# Altium project 20_AS_NodePCB.PrjPcb
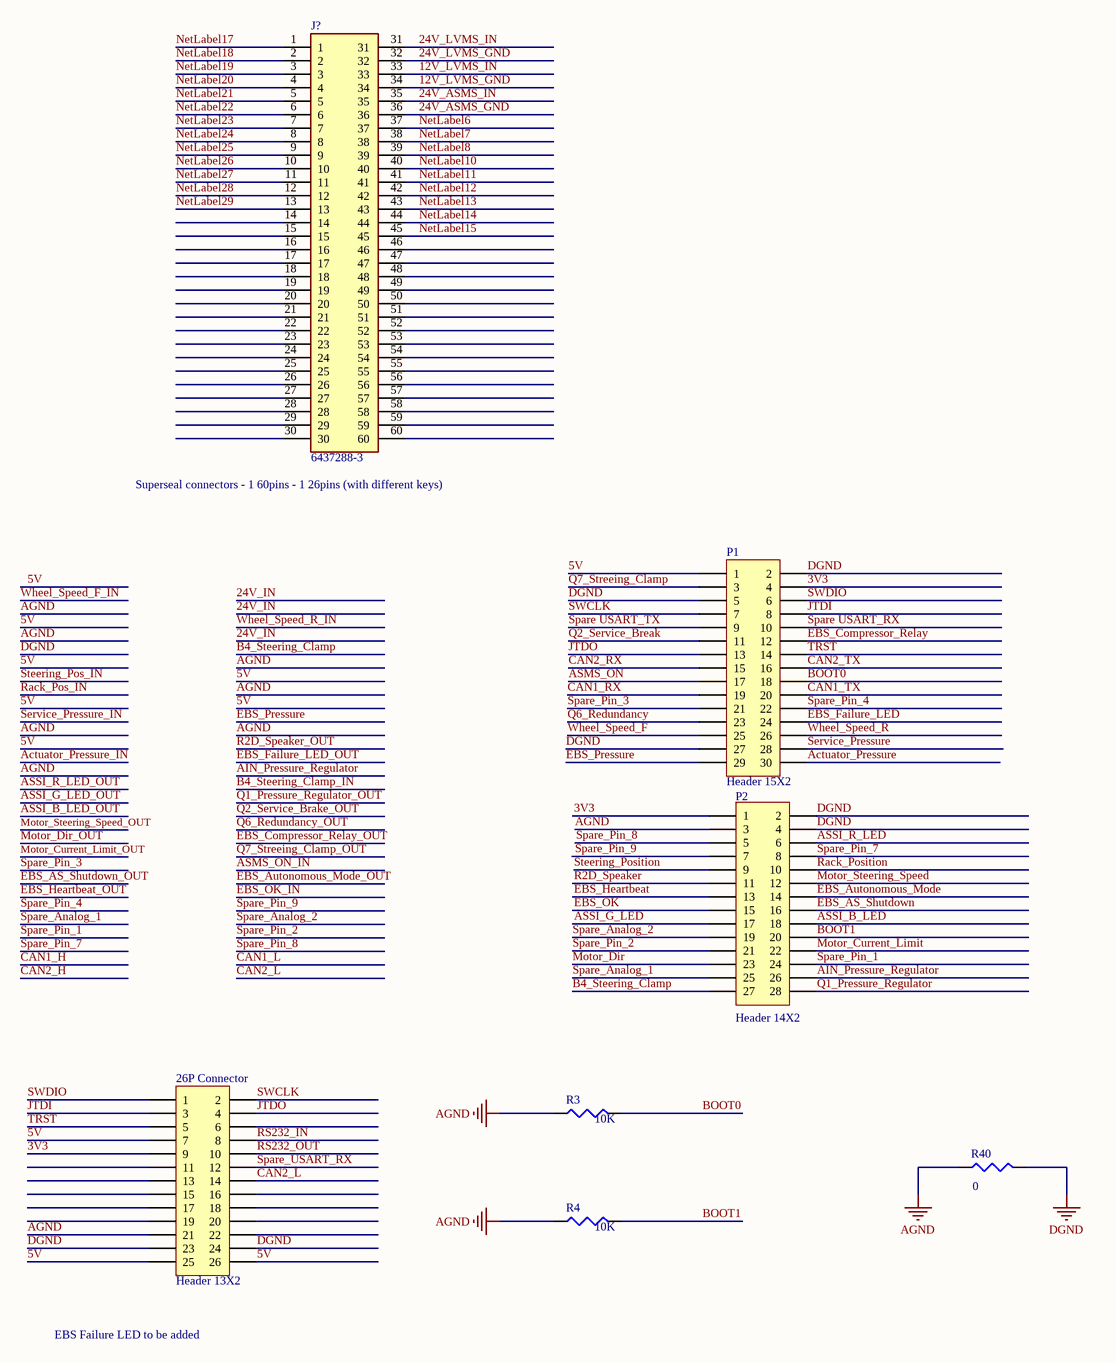
[diagram p0: AS_Node_Connectors.SchDoc]
3 sheets, 44 parts. Net scope: global (net labels, ports and power ports of the same name join across sheets).
Board file: AS_node_pcb_version2.PcbDoc
Sheets:
  AS_Node_Connectors.SchDoc
  AS_Node_Inputs.SchDoc
  AS_Node_Voltage_Regulators.SchDoc

## Sheet AS_Node_Connectors.SchDoc
size A2

### Parts
26P_Connector  Header 13X2  [CONN26_9-6437287]
J?  6437288-3  [6437288-3]
P1  Header 15X2  [30_connector_male]
P2  Header 14X2  [28 _connector_male]
R3  value 10K  [SMD-0805-RES]  (hidden comment: Res3)
R4  value 10K  [SMD-0805-RES]  (hidden comment: Res3)
R40  value 0  [SMD-0805-RES]  (hidden comment: Res3)

### Nets
3V3: 26P_Connector.9 P1.4 P2.1
AGND: 26P_Connector.21 P2.3 R3.1 R4.1 R40.1
DGND: 26P_Connector.23 26P_Connector.24 P1.2 P1.5 P1.27 P2.2 P2.4 R40.2
5V: 26P_Connector.7 26P_Connector.25 26P_Connector.26 P1.1
12V_LVMS_GND: J?.34
12V_LVMS_IN: J?.33
24V_ASMS_GND: J?.36
24V_ASMS_IN: J?.35
24V_LVMS_GND: J?.32
24V_LVMS_IN: J?.31
Actuator_Pressure: P1.30
AIN_Pressure_Regulator: P2.26
ASMS_ON: P1.17
ASSI_B_LED: P2.18
ASSI_G_LED: P2.17
ASSI_R_LED: P2.6
B4_Steering_Clamp: P2.27
BOOT0: P1.18 R3.2
BOOT1: P2.20 R4.2
CAN1_RX: P1.19
CAN1_TX: P1.20
CAN2_L: 26P_Connector.14
CAN2_RX: P1.15
CAN2_TX: P1.16
EBS_AS_Shutdown: P2.16
EBS_Autonomous_Mode: P2.14
EBS_Compressor_Relay: P1.12
EBS_Failure_LED: P1.24
EBS_Heartbeat: P2.13
EBS_OK: P2.15
EBS_Pressure: P1.29
JTDI: 26P_Connector.3 P1.8
JTDO: 26P_Connector.4 P1.13
Motor_Current_Limit: P2.22
Motor_Dir: P2.23
Motor_Steering_Speed: P2.12
NetLabel6: J?.37
NetLabel7: J?.38
NetLabel8: J?.39
NetLabel10: J?.40
NetLabel11: J?.41
NetLabel12: J?.42
NetLabel13: J?.43
NetLabel14: J?.44
NetLabel15: J?.45
NetLabel17: J?.1
NetLabel18: J?.2
NetLabel19: J?.3
NetLabel20: J?.4
NetLabel21: J?.5
NetLabel22: J?.6
NetLabel23: J?.7
NetLabel24: J?.8
NetLabel25: J?.9
NetLabel26: J?.10
NetLabel27: J?.11
NetLabel28: J?.12
NetLabel29: J?.13
Q1_Pressure_Regulator: P2.28
Q2_Service_Break: P1.11
Q6_Redundancy: P1.23
Q7_Streeing_Clamp: P1.3
R2D_Speaker: P2.11
Rack_Position: P2.10
RS232_IN: 26P_Connector.8
RS232_OUT: 26P_Connector.10
Service_Pressure: P1.28
Spare USART_RX: P1.10
Spare USART_TX: P1.9
Spare_Analog_1: P2.25
Spare_Analog_2: P2.19
Spare_Pin_1: P2.24
Spare_Pin_2: P2.21
Spare_Pin_3: P1.21
Spare_Pin_4: P1.22
Spare_Pin_7: P2.8
Spare_Pin_8: P2.5
Spare_Pin_9: P2.7
Spare_USART_RX: 26P_Connector.12
Steering_Position: P2.9
SWCLK: 26P_Connector.2 P1.7
SWDIO: 26P_Connector.1 P1.6
TRST: 26P_Connector.5 P1.14
Wheel_Speed_F: P1.25
Wheel_Speed_R: P1.26

Not connected (* = marked no-connect by the designer): 26P_Connector 6 11 13 15 16 17 18 19 20 22; J? 14 15 16 17 18 19 20 21 22 23 24 25 26 27 28 29 30 46 47 48 49 50 51 52 53 54 55 56 57 58 59 60

### Notes on the sheet
- (near J?) Superseal connectors - 1 60pins - 1 26pins (with different keys)
- EBS Failure LED to be added

### Library data of the parts
26P_Connector = Header 13X2: Header, 13-Pin, Dual row; LatestRevisionDate: 17-Jul-2002; LatestRevisionNote: Re-released for DXP Platform.; Publisher: Altium Limited
J? = 6437288-3: Connector; Manufacturer_Name: TE Connectivity; Datasheet Link: https://componentsearchengine.com/Datasheets/1/6437288-3.pdf; Mouser2 Part Number: 571-6437288-3; Mouser2 Price/Stock: https://www.mouser.com/Search/Refine.aspx?Keyword=571-6437288-3; Manufacturer_Part_Number: 6437288-3
P1 = Header 15X2: Header, 15-Pin, Dual row; Manufacturer: Wurth Electronics Inc; Manufacturer Part Number: 61303021121; Connector Type: Header, Unshrouded; Number of Positions: 30; Number of Positions Loaded: All; Pitch: 0.100" (2.54mm); Supplier 1: Digi-Key; Supplier Part Number 1: 732-5306-ND; RoHS: RoHS Compliant; Category: Connectors, Interconnects; Stock 1: 127; Pricing 1: 1=1.57, 100=1.404, 500=1.188, 10000=0.702 (USD); Packaging: Bulk; Part Status: Active; Contact Type: Male Pin; Number of Rows: 2; Row Spacing: 0.100" (2.54mm); Contact Mating Length: 0.236" (6.00mm); Mounting Type: Through Hole; Termination: Solder; Fastening Type: -; Features: -; Contact Finish: Gold; Contact Finish Thickness: -; Color: Black; ComponentLink1URL: http://katalog.we-online.de/em/datasheet/6130xx21121.pdf; ComponentLink1Description: http://katalog.we-online.de/em/datasheet/6130xx21121.pdf
P2 = Header 14X2: Header, 14-Pin, Dual row; Manufacturer: Wurth Electronics Inc; Manufacturer Part Number: 61302821121; Connector Type: Header, Unshrouded; Number of Positions: 28; Number of Positions Loaded: All; Pitch: 0.100" (2.54mm); Supplier 1: Digi-Key; Supplier Part Number 1: 732-5305-ND; RoHS: RoHS Compliant; Category: Connectors, Interconnects; Stock 1: 2; Pricing 1: 1=1.49, 100=1.3338, 500=1.1286, 10000=0.6669 (USD); Packaging: Bulk; Part Status: Active; Contact Type: Male Pin; Number of Rows: 2; Row Spacing: 0.100" (2.54mm); Contact Mating Length: 0.236" (6.00mm); Mounting Type: Through Hole; Termination: Solder; Fastening Type: -; Features: -; Contact Finish: Gold; Contact Finish Thickness: -; Color: Black; ComponentLink1URL: http://katalog.we-online.de/em/datasheet/6130xx21121.pdf; ComponentLink1Description: http://katalog.we-online.de/em/datasheet/6130xx21121.pdf
R3 R4 R40 = Res3: Resistor; Published: 8-Jun-2000; LatestRevisionDate: 29-May-2009; LatestRevisionNote: IPC-7351 Footprint Added.; PackageReference: J1-0603; Publisher: Altium Limited; PackageDescription: Chip Resistor

## Sheet AS_Node_Inputs.SchDoc
size A4
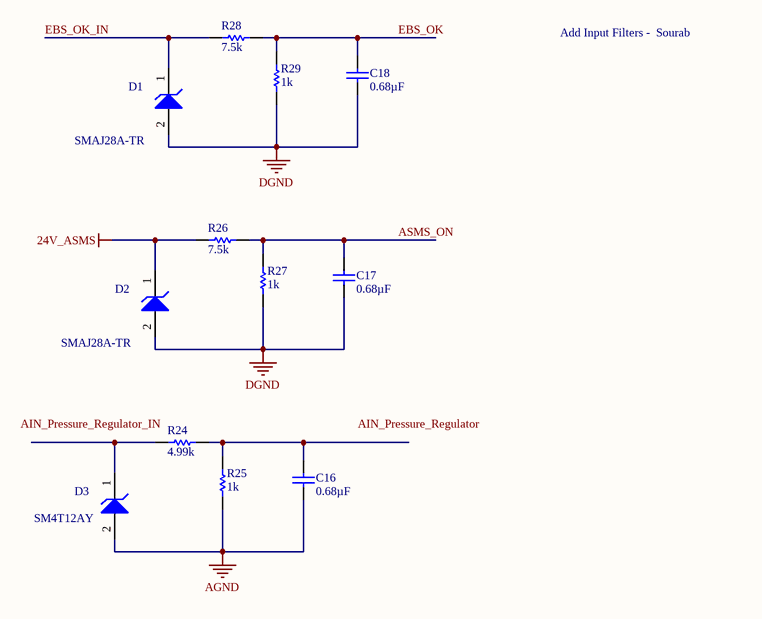
[diagram p1: AS_Node_Inputs.SchDoc]

### Parts
C16  0.68µF  [dV_C0805]
C17  0.68µF  [dV_C0805]
C18  0.68µF  [dV_C0805]
D1  Manufacturer Part Number: SMAJ28A-TR  [1SMA12AT3G]
D2  Manufacturer Part Number: SMAJ28A-TR  [1SMA12AT3G]
D3  Manufacturer Part Number: SM4T12AY  [1SMA12AT3G]
R24  4.99k  [dV_R0805]
R25  1k  [dV_R0805]
R26  7.5k  [dV_R0805]
R27  1k  [dV_R0805]
R28  7.5k  [dV_R0805]
R29  1k  [dV_R0805]

### Nets
24V_ASMS: D2.1(K) R26.2
AGND: C16.1 D3.2(A) R25.2
DGND: C17.1 C18.1 D1.2(A) D2.2(A) R27.2 R29.2
ASMS_ON: C17.2 R26.1 R27.1
EBS_OK: C18.2 R28.1 R29.1
EBS_OK_IN: D1.1(K) R28.2
NetC16_2: C16.2 R24.1 R25.1
NetD3_1: D3.1(K) R24.2

### Notes on the sheet
- Add Input Filters -  Sourab
- Labels drawn without touching a wire or pin: AIN_Pressure_Regulator, AIN_Pressure_Regulator_IN

### Library data of the parts
C16-C18 = Cap: Manufacturer: KEMET; Manufacturer Part Number: C0805C684J3NACTU; Ceramic Capacitor Case: 0805 [2012 Metric]; Voltage Rating: 25; Capacitance Tolerance: ± 5%; Dielectric Characteristic: X8; Product Range: C Series; SVHC: No SVHC (15-Jun-2015)<!--FANDB--><div class="features-and-benefits-container"><div class="features-and-benefits-desc-container"><span class="features-and-benefits-container-desc">SMD Multilayer Ceramic Capacitor, 0805 [2012 Metric], 0.68 µF, 25 V, ± 5%, X8L, C Series</span></div><div class="features-and-benefits-description"><span class="features-benefits-value">The X8L dielectric features a 150°C maximum operating temperature and is considered "general purpose high temperature." These components are fixed, ceramic dielectric capacitors suited for high temperature bypass and decoupling applications or frequency discriminating circuits where Q and stability of capacitance characteristics are not critical. X8L exhibits a predictable change in capacitance with respect to time and voltage and boasts a minimal change in capacitance with reference to ambient temperature up to 125°C. Beyond 125°C X8L displays a wider variation in capacitance. Capacitance change is limited to ±15% from ?55°C to +125°C and +15, ?40% from 125°C to 150°C.</span></div><div class="features-and-benefits-list"><ul class="features-and-benefits-list-list"><li class="features-and-benefits-list-item">Operating temperature range from -55°C to 150°C</li><li class="features-and-benefits-list-item">Capacitance values ranging from 0.012µF to 10µF</li><li class="features-and-benefits-list-item">EIA 0402, 0603, 0805, 1206 and 1210 case sizes available</li><li class="features-and-benefits-list-item">DC voltage rating of 10V, 16V, 25V and 50; Supplier 1: Farnell; Supplier Part Number 1: 2575955; RoHS: YES; Stock 1: 576; Pricing 1: 5=0.718, 50=0.419, 250=0.279, 500=0.228, 1000=0.193, 2500=0.186, 12500=0.179 (GBP); Capacitance: 0.68µF; Packaging: Cut Tape; Operating Temperature Min: -55; Operating Temperature Max: 150; Automotive Qualification Standard: -; MSL: MSL 1 - Unlimited; ComponentLink1URL: http://www.farnell.com/datasheets/2321109.pdf; ComponentLink1Description: http://www.farnell.com/datasheets/2321109.pdf; ComponentLink2URL: https://youtu.be/PxmtxV5n2KM?list=PLa3x8V-ZYWEUNRPUyCTjknYUhI9vvDZu9; ComponentLink2Description: https://youtu.be/PxmtxV5n2KM?list=PLa3x8V-ZYWEUNRPUyCTjknYUhI9vvDZu9; ComponentLink3URL: http://www.farnell.com/datasheets/2315665.pdf; ComponentLink3Description: http://www.farnell.com/datasheets/2315665.pdf; ComponentLink4URL: http://www.farnell.com/cad/2268906.zip; ComponentLink4Description: http://www.farnell.com/cad/2268906.zip
D1 D2 = TVS diodes: Manufacturer: STMICROELECTRONICS; Product Range: TRANSZORB SMAJ Series; TVS Polarity: Unidirectional; Reverse Stand-Off Voltage Vrwm: 28; Clamping Voltage Vc Max: 59; Diode Case Style: DO-214; No. of Pins: 2; Breakdown Voltage Min: 31.1; Breakdown Voltage Max: 32.7; Peak Pulse Power Dissipation: 400; SVHC: No SVHC (17-Dec-2015); Capacitance Cd @ Vr Typ: 510; Current Ir Max: 1; Diode Type: Unidirectional TVS; External Depth: 5.6; External Length / Height: 2.9; Forward Surge Current Ifsm Max: 40; Peak Pulse Current Ippm: 8.8; SMD Marking: CG; Stand-off Voltage: 28V<!--FANDB--><div class="features-and-benefits-container"><div class="features-and-benefits-desc-container"><span class="features-and-benefits-container-desc">TVS Diode, TRANSZORB SMAJ Series, Unidirectional, 28 V, 59 V, DO-214AC, 2 Pins</span></div><div class="features-and-benefits-description"><span class="features-benefits-value">The Transil SMAJ series TVS Diode designed to protect sensitive equipment against electrostatic discharges according to IEC 61000-4-2, MIL STD 883, method 3015 and electrical over stress according to IEC 61000-4-4 and 5. It is generally used against surges below 400W (10/1000?s). Planar technology makes these devices suitable for high-end equipment and SMPS where low leakage current and high junction temperature are required to provide reliability and stability over time.</span></div><div class="features-and-benefits-list"><ul class="features-and-benefits-list-list"><li class="features-and-benefits-list-item">5 to 188V Stand off voltage range</li><li class="features-and-benefits-list-item">0.2µA at 25°C and 1µA at 85°C Low leakage current</li><li class="features-and-benefits-list-item">270W (10/1000µs) High power capability at Tj max</li><li class="features-and-benefits-list-item">-55 to 150; Supplier 1: Farnell; Supplier Part Number 1: 9802797; RoHS: YES; Stock 1: 24650; Pricing 1: 10=0.143, 100=0.0657, 500=0.0652, 1000=0.0648, 2500=0.0643 (GBP); Packaging: Cut Tape; Automotive Qualification Standard: -; Alternate Case Style: DO-214; Breakover Voltage Min: 31.1; Clamping Voltage @ 8/20µs Max: 59; External Width: 2.9; MSL: MSL 1 - Unlimited; Power Dissipation Pd: 400; Reverse Leakage Current Max: 1; Reverse Voltage Vr Max: 28; ComponentLink1URL: http://www.farnell.com/datasheets/1724007.pdf; ComponentLink1Description: http://www.farnell.com/datasheets/1724007.pdf; ComponentLink2URL: http://www.farnell.com/datasheets/2158622.pdf; ComponentLink2Description: http://www.farnell.com/datasheets/2158622.pdf
D3 = TVS diodes: Manufacturer: STMICROELECTRONICS; Product Range: Transil SM4; TVS Polarity: Unidirectional; Reverse Stand-Off Voltage Vrwm: 10; Clamping Voltage Vc Max: 21.7; Diode Case Style: DO-214; No. of Pins: 2; Breakdown Voltage Min: 11.1; Breakdown Voltage Max: 12.3; Peak Pulse Power Dissipation: 400; Automotive Qualification Standard: AEC-Q101; SVHC: No SVHC (17-Dec-2015); Peak Pulse Current Ippm: 106; Power Dissipation Pd: 400W<!--FANDB--><div class="features-and-benefits-container"><div class="features-and-benefits-desc-container"><span class="features-and-benefits-container-desc">TVS Diode, Transil SM4TY Series, Unidirectional, 10 V, 21.7 V, DO-214AC, 2 Pins</span></div><div class="features-and-benefits-description"><span class="features-benefits-value">The Transil SM4TY series TVS Diode designed to protect sensitive automotive circuits against surges defined in ISO 7637-2 and against electrostatic discharges according to ISO 10605. The planar technology makes it compatible with high-end circuits where low leakage current and high junction temperature are required to provide reliability and stability over time.</span></div><div class="features-and-benefits-list"><ul class="features-and-benefits-list-list"><li class="features-and-benefits-list-item">5 to 70V Stand off voltage range</li><li class="features-and-benefits-list-item">Unidirectional and bidirectional types</li><li class="features-and-benefits-list-item">270W (10/1000µs) High power capability at Tj max</li><li class="features-and-benefits-list-item">-55 to 150; Supplier 1: Farnell; Supplier Part Number 1: 2327858; RoHS: YES; Stock 1: 1079; Pricing 1: 1=0.552, 25=0.511, 100=0.301, 250=0.277, 500=0.26, 1000=0.226, 3000=0.188, 9000=0.163 (GBP); Packaging: Cut Tape; MSL: MSL 1 - Unlimited; ComponentLink1URL: http://www.farnell.com/datasheets/1997806.pdf; ComponentLink1Description: http://www.farnell.com/datasheets/1997806.pdf
R24 = Res1: Manufacturer: PANASONIC ELECTRONIC COMPONENTS; Manufacturer Part Number: ERA6AEB4991V; Voltage Rating: 100; Resistor Element Material: Thin Film; Resistor Case Style: 0805 [2012 Metric]; Power Rating: 125; Resistance Tolerance: ± 0.1%; Product Range: ERA6; Temperature Coefficient: ± 25; Automotive Qualification Standard: AEC-Q200; SVHC: No SVHC (07-Jul-2017); External Depth: 1.25; External Length / Height: 0.5; External Width: 2; Resistor Mounting: Surface Mount Device<!--FANDB--><div class="features-and-benefits-container"><div class="features-and-benefits-desc-container"><span class="features-and-benefits-container-desc">SMD Chip Resistor, 4.99 kohm, 100 V, Thin Film, 0805 [2012 Metric], 125 mW, ± 0.1%</span></div><div class="features-and-benefits-description"><span class="features-benefits-value">The Panasonic ERA 6A series resistors are highly reliable, automotive grade metal film chip resistors based on thin film technology. The resistance range includes E24 and E96 decade values from 10 ohm to 1Mohm. ERA series metal thin film chip resistors have small resistance tolerance and temperature coefficient of resistance, low current noise and excellent linearity. These resistors are stable at high temperature and humidity.</span></div><div class="features-and-benefits-list"><ul class="features-and-benefits-list-list"><li class="features-and-benefits-list-item">EIA 0201, 0402, 0603, 0805, 1206 case sizes available</li><li class="features-and-benefits-list-item">Automotive grade AEC-Q200 compliant</li><li class="features-and-benefits-list-item">Meets IEC 60115-8, JIS C 5201-8, EIAJ RC-2133B standards</li><li class="features-and-benefits-list-item">85°C 85% RH rated load</li><li class="features-and-benefits-list-item">Maximum power rating of 250mW</li><li class="features-and-benefits-list-item">Available in ±0.05%, ±0.1%, ±0.25% and ±0.5% tolerance</li><li class="features-and-benefits-list-item">±10, ±15, ±25, ±50 and ±100ppm/°C TCR values available</li><li class="features-and-benefits-list-item">Operating temperature range -55°C to 155; Supplier 1: Farnell; Supplier Part Number 1: 1810573; RoHS: YES; Stock 1: 6882; Pricing 1: 10=0.237, 100=0.0981, 500=0.08, 1000=0.0553, 2500=0.0492 (GBP); Resistance: 4.99k; Packaging: Cut Tape; No. of Pins: 2; Operating Temperature Max: 155; Operating Temperature Min: -55; Operating Temperature Range: -55°C to +155; ComponentLink1URL: http://www.farnell.com/datasheets/2052875.pdf; ComponentLink1Description: http://www.farnell.com/datasheets/2052875.pdf; ComponentLink2URL: http://www.farnell.com/datasheets/1718548.pdf; ComponentLink2Description: http://www.farnell.com/datasheets/1718548.pdf; ComponentLink3URL: http://www.farnell.com/cad/1697890.zip; ComponentLink3Description: http://www.farnell.com/cad/1697890.zip
R25 R27 R29 = Res1: Manufacturer: PANASONIC ELECTRONIC COMPONENTS; Manufacturer Part Number: ERA6AEB102V; Voltage Rating: 100; Resistor Element Material: Thin Film; Resistor Case Style: 0805 [2012 Metric]; Power Rating: 125; Resistance Tolerance: ± 0.1%; Product Range: ERA6; Temperature Coefficient: ± 25; Automotive Qualification Standard: AEC-Q200; SVHC: No SVHC (07-Jul-2017)<!--FANDB--><div class="features-and-benefits-container"><div class="features-and-benefits-desc-container"><span class="features-and-benefits-container-desc">SMD Chip Resistor, 1 kohm, 100 V, Thin Film, 0805 [2012 Metric], 125 mW, ± 0.1%</span></div><div class="features-and-benefits-description"><span class="features-benefits-value">The Panasonic ERA 6A series resistors are highly reliable, automotive grade metal film chip resistors based on thin film technology. The resistance range includes E24 and E96 decade values from 10 ohm to 1Mohm. ERA series metal thin film chip resistors have small resistance tolerance and temperature coefficient of resistance, low current noise and excellent linearity. These resistors are stable at high temperature and humidity.</span></div><div class="features-and-benefits-list"><ul class="features-and-benefits-list-list"><li class="features-and-benefits-list-item">EIA 0201, 0402, 0603, 0805, 1206 case sizes available</li><li class="features-and-benefits-list-item">Automotive grade AEC-Q200 compliant</li><li class="features-and-benefits-list-item">Meets IEC 60115-8, JIS C 5201-8, EIAJ RC-2133B standards</li><li class="features-and-benefits-list-item">85°C 85% RH rated load</li><li class="features-and-benefits-list-item">Maximum power rating of 250mW</li><li class="features-and-benefits-list-item">Available in ±0.05%, ±0.1%, ±0.25% and ±0.5% tolerance</li><li class="features-and-benefits-list-item">±10, ±15, ±25, ±50 and ±100ppm/°C TCR values available</li><li class="features-and-benefits-list-item">Operating temperature range -55°C to 155; Supplier 1: Farnell; Supplier Part Number 1: 1577659; RoHS: YES; Stock 1: 58725; Pricing 1: 10=0.237, 100=0.0981, 500=0.08, 1000=0.0551, 2500=0.0482 (GBP); Resistance: 1k; Packaging: Cut Tape; ComponentLink1URL: http://www.farnell.com/datasheets/2052875.pdf; ComponentLink1Description: http://www.farnell.com/datasheets/2052875.pdf; ComponentLink2URL: http://www.farnell.com/datasheets/1718548.pdf; ComponentLink2Description: http://www.farnell.com/datasheets/1718548.pdf; ComponentLink3URL: http://www.farnell.com/cad/1684671.zip; ComponentLink3Description: http://www.farnell.com/cad/1684671.zip
R26 R28 = Res1: Manufacturer: PANASONIC ELECTRONIC COMPONENTS; Manufacturer Part Number: ERA6AEB752V; Voltage Rating: 100; Resistor Element Material: Thin Film; Resistor Case Style: 0805 [2012 Metric]; Power Rating: 125; Resistance Tolerance: ± 0.1%; Product Range: ERA6; Temperature Coefficient: ± 25; Automotive Qualification Standard: AEC-Q200; SVHC: No SVHC (07-Jul-2017); No. of Pins: 2; Resistor Mounting: Surface Mount Device<!--FANDB--><div class="features-and-benefits-container"><div class="features-and-benefits-desc-container"><span class="features-and-benefits-container-desc">SMD Chip Resistor, 7.5 kohm, 100 V, Thin Film, 0805 [2012 Metric], 125 mW, ± 0.1%</span></div><div class="features-and-benefits-description"><span class="features-benefits-value">The Panasonic ERA 6A series resistors are highly reliable, automotive grade metal film chip resistors based on thin film technology. The resistance range includes E24 and E96 decade values from 10 ohm to 1Mohm. ERA series metal thin film chip resistors have small resistance tolerance and temperature coefficient of resistance, low current noise and excellent linearity. These resistors are stable at high temperature and humidity.</span></div><div class="features-and-benefits-list"><ul class="features-and-benefits-list-list"><li class="features-and-benefits-list-item">EIA 0201, 0402, 0603, 0805, 1206 case sizes available</li><li class="features-and-benefits-list-item">Automotive grade AEC-Q200 compliant</li><li class="features-and-benefits-list-item">Meets IEC 60115-8, JIS C 5201-8, EIAJ RC-2133B standards</li><li class="features-and-benefits-list-item">85°C 85% RH rated load</li><li class="features-and-benefits-list-item">Maximum power rating of 250mW</li><li class="features-and-benefits-list-item">Available in ±0.05%, ±0.1%, ±0.25% and ±0.5% tolerance</li><li class="features-and-benefits-list-item">±10, ±15, ±25, ±50 and ±100ppm/°C TCR values available</li><li class="features-and-benefits-list-item">Operating temperature range -55°C to 155; Supplier 1: Farnell; Supplier Part Number 1: 1670239; RoHS: YES; Stock 1: 4190; Pricing 1: 10=0.237, 100=0.0981, 500=0.08, 1000=0.0553, 2500=0.0492 (GBP); Resistance: 7.5k; Packaging: Cut Tape; Operating Temperature Max: 155; Operating Temperature Min: -55; Operating Temperature Range: -55°C to +155; ComponentLink1URL: http://www.farnell.com/datasheets/2052875.pdf; ComponentLink1Description: http://www.farnell.com/datasheets/2052875.pdf; ComponentLink2URL: http://www.farnell.com/datasheets/1718548.pdf; ComponentLink2Description: http://www.farnell.com/datasheets/1718548.pdf; ComponentLink3URL: http://www.farnell.com/cad/1559844.zip; ComponentLink3Description: http://www.farnell.com/cad/1559844.zip

## Sheet AS_Node_Voltage_Regulators.SchDoc
size A4
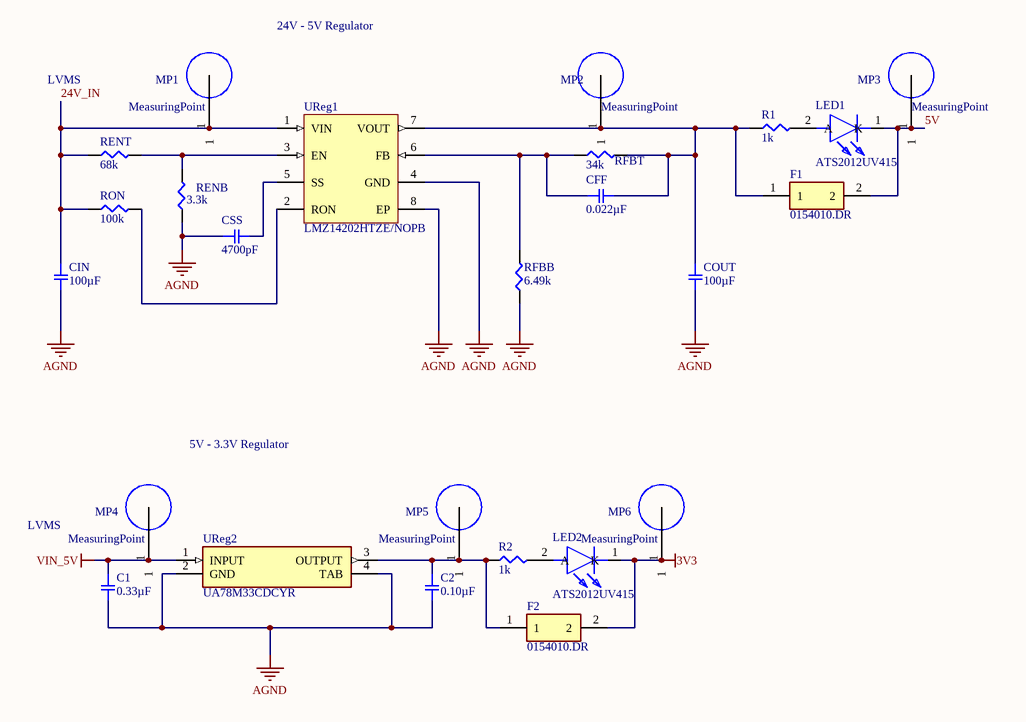
[diagram p2: AS_Node_Voltage_Regulators.SchDoc]

### Parts
C1  0.33µF  [SMD-0805C]
C2  0.10µF  [SMD-0805C]
CFF  0.022µF  [SMD-0805C]
CIN  100µF  [SMD-0805C]
COUT  100µF  [SMD-0805C]
CSS  4700pF  [SMD-0805C]
F1  0154010.DR  [0154001.DRT]
F2  0154010.DR  [0154001.DRT]
LED1  ATS2012UV415  [ATS2012UV415]
LED2  ATS2012UV415  [ATS2012UV415]
MP1  MeasuringPoint  [MeasuringPoint]
MP2  MeasuringPoint  [MeasuringPoint]
MP3  MeasuringPoint  [MeasuringPoint]
MP4  MeasuringPoint  [MeasuringPoint]
MP5  MeasuringPoint  [MeasuringPoint]
MP6  MeasuringPoint  [MeasuringPoint]
R1  1k  [SMD-0805-RES]
R2  1k  [SMD-0805-RES]
RENB  3.3k  [SMD-0805-RES]
RENT  68k  [SMD-0805-RES]
RFBB  6.49k  [SMD-0805-RES]
RFBT  34k  [SMD-0805-RES]
RON  100k  [SMD-0805-RES]
UReg1  LMZ14202HTZE/NOPB  [NDW0007A_V]
UReg2  UA78M33CDCYR  [SOT230P700X180-4N]

### Nets
3V3: F2.2 LED2.1(K) MP6.1
AGND: C1.2 C2.2 CIN.2 COUT.2 CSS.1 RENB.1 RFBB.1 UReg1.4(GND) UReg1.8(EP) UReg2.2(GND) UReg2.4(TAB)
VIN_5V: C1.1 MP4.1 UReg2.1(INPUT)
5V: F1.2 LED1.1(K) MP3.1
24V_IN: CIN.1 MP1.1 RENT.1 RON.1 UReg1.1(VIN)
NetC2_1: C2.1 F2.1 MP5.1 R2.1 UReg2.3(OUTPUT)
NetCFF_1: CFF.1 RFBB.2 RFBT.1 UReg1.6(FB)
NetCFF_2: CFF.2 COUT.1 F1.1 MP2.1 R1.1 RFBT.2 UReg1.7(VOUT)
NetCSS_2: CSS.2 UReg1.5(SS)
NetLED1_2: LED1.2(A) R1.2
NetLED2_2: LED2.2(A) R2.2
NetRENB_2: RENB.2 RENT.2 UReg1.3(EN)
NetRON_2: RON.2 UReg1.2(RON)

### Notes on the sheet
- 24V - 5V Regulator
- LVMS
- 5V - 3.3V Regulator

### Library data of the parts
C1 = GCM21BL81H334KA56L: CAP CER 0.33UF 50V X8L 0805; Manufacturer: Murata Electronics North America; Factory Stock: 0; Unit Price (USD): 0.41; Minimum Quantity: 1; Tolerance: ±10%; Value: 0.33µF; Datasheets: http://www.murata.com/~/media/webrenewal/support/library/catalog/products/capacitor/mlcc/c03e.ashx; Image: //media.digikey.com/photos/Murata%20Photos/NCP,GCM%20SERIES%200805.jpg; Digi-Key Part Number: 490-11962-1-ND; Part Number: GCM21BL81H334KA56L; Quantity Available: 2723; @ qty: 0; Packaging: Cut Tape (CT); Series: GCM; Part Status: Active; Voltage: 50V; Temperature Coefficient: X8L; Operating Temperature: -55°C ~ 150°C; Features: -; Ratings: AEC-Q200; Applications: Automotive; Mounting Type: Surface Mount, MLCC; Package / Case: 0805 (2012 Metric); Size / Dimension: 0.079" L x 0.049" W (2.00mm x 1.25mm); Height - Seated (Max): -; Thickness (Max): 0.055" (1.40mm); Lead Spacing: -; Lead Style: -
C2 = GCD21BR71H104KA01L: CAP CER 0.1UF 50V X7R 0805; Manufacturer: Murata Electronics North America; Factory Stock: 0; Unit Price (USD): 0.24; Minimum Quantity: 1; Tolerance: ±10%; Value: 0.10µF; Datasheets: http://www.murata.com/~/media/webrenewal/support/library/catalog/products/capacitor/mlcc/c03e.ashx; Image: //media.digikey.com/Renders/Murata%20Renders/0805%28GxM6%29.jpg; Digi-Key Part Number: 490-11955-1-ND; Part Number: GCD21BR71H104KA01L; Quantity Available: 157; @ qty: 0; Packaging: Cut Tape (CT); Series: GCD; Part Status: Active; Voltage: 50V; Temperature Coefficient: X7R; Operating Temperature: -55°C ~ 125°C; Features: -; Ratings: AEC-Q200; Applications: Automotive; Mounting Type: Surface Mount, MLCC; Package / Case: 0805 (2012 Metric); Size / Dimension: 0.079" L x 0.049" W (2.00mm x 1.25mm); Height - Seated (Max): -; Thickness (Max): 0.049" (1.25mm); Lead Spacing: -; Lead Style: -
CFF = GC321BD72E223KX03L: CAP CER 0.022UF 250V X7T 0805; Manufacturer: Murata Electronics North America; Factory Stock: 0; Unit Price (USD): 0.27; Minimum Quantity: 1; Tolerance: ±10%; Value: 0.022µF; Datasheets: http://search.murata.co.jp/Ceramy/image/img/A01X/G101/ENG/GC321BD72E223KX03-01.pdf; Image: //media.digikey.com/Renders/Murata%20Renders/0805(GC3)200x125.jpg; Digi-Key Part Number: 490-13988-1-ND; Part Number: GC321BD72E223KX03L; Quantity Available: 3000; @ qty: 0; Packaging: Cut Tape (CT); Series: GC3; Part Status: Active; Voltage: 250V; Temperature Coefficient: X7T; Operating Temperature: -55°C ~ 125°C; Features: -; Ratings: AEC-Q200; Applications: Automotive; Mounting Type: Surface Mount, MLCC; Package / Case: 0805 (2012 Metric); Size / Dimension: 0.079" L x 0.049" W (2.00mm x 1.25mm); Height - Seated (Max): -; Thickness (Max): 0.057" (1.45mm); Lead Spacing: -; Lead Style: -
CIN COUT = GRM21BC80E107ME15L: CAP CER 100UF 2.5V X6S 0805; Manufacturer: Murata Electronics North America; Factory Stock: 0; Unit Price (USD): 2.17; Minimum Quantity: 1; Tolerance: ±20%; Value: 100µF; Datasheets: http://search.murata.co.jp/Ceramy/image/img/A01X/G101/ENG/GRM21BC80E107ME15-01.pdf; Image: //media.digikey.com/Renders/Murata%20Renders/0805%20(2012%20Metric)%20.85mm.jpg; Digi-Key Part Number: 490-13977-1-ND; Part Number: GRM21BC80E107ME15L; Quantity Available: 5990; @ qty: 0; Packaging: Cut Tape (CT); Series: GRM; Part Status: Active; Voltage: 2.5V; Temperature Coefficient: X6S; Operating Temperature: -55°C ~ 105°C; Features: -; Ratings: -; Applications: General Purpose; Mounting Type: Surface Mount, MLCC; Package / Case: 0805 (2012 Metric); Size / Dimension: 0.079" L x 0.049" W (2.00mm x 1.25mm); Height - Seated (Max): -; Thickness (Max): 0.057" (1.45mm); Lead Spacing: -; Lead Style: -
CSS = GCJ21AR72E472KXJ1D: CAP CER 4700PF 250V X7R 0805; Manufacturer: Murata Electronics North America; Factory Stock: 0; Unit Price (USD): 0.3; Minimum Quantity: 1; Tolerance: ±10%; Value: 4700pF; Datasheets: http://www.murata.com/~/media/webrenewal/support/library/catalog/products/capacitor/mlcc/c03e.ashx; Image: //media.digikey.com/Renders/Murata%20Renders/0805%20(2012%20Metric)%20.85mm.jpg; Digi-Key Part Number: 490-5593-1-ND; Part Number: GCJ21AR72E472KXJ1D; Quantity Available: 1082; @ qty: 0; Packaging: Cut Tape (CT); Series: GCJ; Part Status: Active; Voltage: 250V; Temperature Coefficient: X7R; Operating Temperature: -55°C ~ 125°C; Features: Soft Termination; Ratings: AEC-Q200; Applications: Automotive, Boardflex Sensitive; Mounting Type: Surface Mount, MLCC; Package / Case: 0805 (2012 Metric); Size / Dimension: 0.079" L x 0.049" W (2.00mm x 1.25mm); Height - Seated (Max): -; Thickness (Max): 0.039" (1.00mm); Lead Spacing: -; Lead Style: -
F1 F2 = 0154010.DR: Fuse; Manufacturer_Name: LITTELFUSE; Allied_Number: 70519129; Datasheet Link: http://m.littelfuse.com/~/media/electronics/datasheets/fuses/littelfuse_fuse_154_154t_154l_154tl_datasheet.pdf.pdf; Manufacturer_Part_Number: 0154010.DR; Mouser Part Number: 576-0154010.DR; Mouser Price/Stock: https://www.mouser.com/Search/Refine.aspx?Keyword=576-0154010.DR; RS Part Number: 7382867; RS Price/Stock: https://uk.rs-online.com/web/p/products/7382867; Allied Price/Stock: https://www.alliedelec.com/littelfuse-0154010-dr/70519129/
LED1 LED2 = ATS2012UV415: LED; Manufacturer_Name: Kingbright; Datasheet Link: https://componentsearchengine.com/Datasheets/1/ATS2012UV415.pdf; Height: 1mm; Mouser2 Part Number: 604-ATS2012UV415; Mouser2 Price/Stock: https://www.mouser.com/Search/Refine.aspx?Keyword=604-ATS2012UV415; Manufacturer_Part_Number: ATS2012UV415
MP1-MP6 = MeasuringPoint: 1,2mm hole for measuring purpose. Designator should be signal name.
R1 R2 = ERJ-6ENF1001V: RES SMD 1K OHM 1% 1/8W 0805; Manufacturer: Panasonic Electronic Components; Factory Stock: 0; Unit Price (USD): 0.00729; @ qty: 1500; Minimum Quantity: 1; Power (Watts): 0.125W, 1/8W; Temperature Coefficient: ±100ppm/°C; Value: 1k; Part Number: ERJ-6ENF1001V; Datasheets: http://industrial.panasonic.com/www-cgi/jvcr13pz.cgi?E+PZ+3+AOA0002+ERJ6ENF1001V+7+WW; Image: //media.digikey.com/Renders/Panasonic%20Renders/ERJ-0805%20Pkg.jpg; Digi-Key Part Number: P1.00KCCT-ND; Quantity Available: 12895103; Packaging: Cut Tape (CT); Series: ERJ; Part Status: Active; Tolerance: ±1%; Composition: Thick Film; Features: Automotive AEC-Q200; Operating Temperature: -55°C ~ 155°C; Package / Case: 0805 (2012 Metric); Supplier Device Package: 0805; Size / Dimension: 0.079" L x 0.049" W (2.00mm x 1.25mm); Height - Seated (Max): 0.028" (0.70mm); Number of Terminations: 2; Failure Rate: -
RENB = ERJ-6ENF3301V: RES SMD 3.3K OHM 1% 1/8W 0805; Manufacturer: Panasonic Electronic Components; Factory Stock: 0; Unit Price (USD): 0.00729; @ qty: 1500; Minimum Quantity: 1; Power (Watts): 0.125W, 1/8W; Temperature Coefficient: ±100ppm/°C; Value: 3.3k; Part Number: ERJ-6ENF3301V; Datasheets: http://industrial.panasonic.com/www-cgi/jvcr13pz.cgi?E+PZ+3+AOA0002+ERJ6ENF3301V+7+WW; Image: //media.digikey.com/Renders/Panasonic%20Renders/ERJ-0805%20Pkg.jpg; Digi-Key Part Number: P3.30KCCT-ND; Quantity Available: 89456; Packaging: Cut Tape (CT); Series: ERJ; Part Status: Active; Tolerance: ±1%; Composition: Thick Film; Features: Automotive AEC-Q200; Operating Temperature: -55°C ~ 155°C; Package / Case: 0805 (2012 Metric); Supplier Device Package: 0805; Size / Dimension: 0.079" L x 0.049" W (2.00mm x 1.25mm); Height - Seated (Max): 0.028" (0.70mm); Number of Terminations: 2; Failure Rate: -
RENT = ERJ-6ENF6802V: RES SMD 68K OHM 1% 1/8W 0805; Manufacturer: Panasonic Electronic Components; Factory Stock: 0; Unit Price (USD): 0.00729; @ qty: 1500; Minimum Quantity: 1; Power (Watts): 0.125W, 1/8W; Temperature Coefficient: ±100ppm/°C; Value: 68k; Part Number: ERJ-6ENF6802V; Datasheets: http://industrial.panasonic.com/www-cgi/jvcr13pz.cgi?E+PZ+3+AOA0002+ERJ6ENF6802V+7+WW; Image: //media.digikey.com/Renders/Panasonic%20Renders/ERJ-0805%20Pkg.jpg; Digi-Key Part Number: P68.0KCCT-ND; Quantity Available: 38245; Packaging: Cut Tape (CT); Series: ERJ; Part Status: Active; Tolerance: ±1%; Composition: Thick Film; Features: Automotive AEC-Q200; Operating Temperature: -55°C ~ 155°C; Package / Case: 0805 (2012 Metric); Supplier Device Package: 0805; Size / Dimension: 0.079" L x 0.049" W (2.00mm x 1.25mm); Height - Seated (Max): 0.028" (0.70mm); Number of Terminations: 2; Failure Rate: -
RFBB = ERJ-6ENF6491V: RES SMD 6.49K OHM 1% 1/8W 0805; Manufacturer: Panasonic Electronic Components; Factory Stock: 0; Unit Price (USD): 0.00729; @ qty: 1500; Minimum Quantity: 1; Power (Watts): 0.125W, 1/8W; Temperature Coefficient: ±100ppm/°C; Value: 6.49k; Part Number: ERJ-6ENF6491V; Datasheets: http://industrial.panasonic.com/www-cgi/jvcr13pz.cgi?E+PZ+3+AOA0002+ERJ6ENF6491V+7+WW; Image: //media.digikey.com/Renders/Panasonic%20Renders/ERJ-0805%20Pkg.jpg; Digi-Key Part Number: P6.49KCCT-ND; Quantity Available: 7881; Packaging: Cut Tape (CT); Series: ERJ; Part Status: Active; Tolerance: ±1%; Composition: Thick Film; Features: Automotive AEC-Q200; Operating Temperature: -55°C ~ 155°C; Package / Case: 0805 (2012 Metric); Supplier Device Package: 0805; Size / Dimension: 0.079" L x 0.049" W (2.00mm x 1.25mm); Height - Seated (Max): 0.028" (0.70mm); Number of Terminations: 2; Failure Rate: -
RFBT = ERJ-6ENF3402V: RES SMD 34K OHM 1% 1/8W 0805; Manufacturer: Panasonic Electronic Components; Factory Stock: 0; Unit Price (USD): 0.00729; @ qty: 1500; Minimum Quantity: 1; Power (Watts): 0.125W, 1/8W; Temperature Coefficient: ±100ppm/°C; Value: 34k; Part Number: ERJ-6ENF3402V; Datasheets: http://industrial.panasonic.com/www-cgi/jvcr13pz.cgi?E+PZ+3+AOA0002+ERJ6ENF3402V+7+WW; Image: //media.digikey.com/Renders/Panasonic%20Renders/ERJ-0805%20Pkg.jpg; Digi-Key Part Number: P34.0KCCT-ND; Quantity Available: 29829; Packaging: Cut Tape (CT); Series: ERJ; Part Status: Active; Tolerance: ±1%; Composition: Thick Film; Features: Automotive AEC-Q200; Operating Temperature: -55°C ~ 155°C; Package / Case: 0805 (2012 Metric); Supplier Device Package: 0805; Size / Dimension: 0.079" L x 0.049" W (2.00mm x 1.25mm); Height - Seated (Max): 0.028" (0.70mm); Number of Terminations: 2; Failure Rate: -
RON = ERJ-6ENF1003V: RES SMD 100K OHM 1% 1/8W 0805; Manufacturer: Panasonic Electronic Components; Factory Stock: 0; Unit Price (USD): 0.00729; @ qty: 1500; Minimum Quantity: 1; Power (Watts): 0.125W, 1/8W; Temperature Coefficient: ±100ppm/°C; Value: 100k; Part Number: ERJ-6ENF1003V; Datasheets: http://industrial.panasonic.com/www-cgi/jvcr13pz.cgi?E+PZ+3+AOA0002+ERJ6ENF1003V+7+WW; Image: //media.digikey.com/Renders/Panasonic%20Renders/ERJ-0805%20Pkg.jpg; Digi-Key Part Number: P100KCCT-ND; Quantity Available: 760677; Packaging: Cut Tape (CT); Series: ERJ; Part Status: Active; Tolerance: ±1%; Composition: Thick Film; Features: Automotive AEC-Q200; Operating Temperature: -55°C ~ 155°C; Package / Case: 0805 (2012 Metric); Supplier Device Package: 0805; Size / Dimension: 0.079" L x 0.049" W (2.00mm x 1.25mm); Height - Seated (Max): 0.028" (0.70mm); Number of Terminations: 2; Failure Rate: -
UReg1 = CMP-0069-02052-2: 2A SIMPLE SWITCHER® Power Module with 42V Maximum Input, 7-pin TO-PMOD, Pb-Free, 45 Rail; Manufacturer: Texas Instruments; PowerWise: Y; PackageTopMarking: NSUZXYTTE#*LMZ14202*HTZ; PackageDescription: TO-PMOD-7, 10.16 x 9.85 x 4.57 mm Body, 7 Lead, 1.27mm Pitch, Surface Mount; ComponentLink1URL: http://www.ti.com/general/docs/lit/getliterature.tsp?genericPartNumber=LMZ14202H&fileType=pdf; RoHS: Y; ComponentLink1Description: Datasheet URL; PackageReference: NDW0007A; CompType: Switcher; PinCount: 7
UReg2 = UA78M33CDCYR: Undefined or Miscellaneous; Manufacturer_Name: Texas Instruments; Datasheet Link: http://www.ti.com/lit/gpn/ua78m; Height: 1.8mm; Manufacturer_Part_Number: UA78M33CDCYR; Mouser Part Number: 595-UA78M33CDCYR; Mouser Price/Stock: https://www.mouser.com/Search/Refine.aspx?Keyword=595-UA78M33CDCYR

## Nets that join several sheets
3V3: AS_Node_Connectors (26P_Connector.9 P1.4 P2.1), AS_Node_Voltage_Regulators (F2.2 LED2.1 MP6.1)
AGND: AS_Node_Connectors (5 pins), AS_Node_Inputs (C16.1 D3.2 R25.2), AS_Node_Voltage_Regulators (11 pins)
DGND: AS_Node_Connectors (8 pins), AS_Node_Inputs (6 pins)
5V: AS_Node_Connectors (26P_Connector.7 26P_Connector.25 26P_Connector.26 P1.1), AS_Node_Voltage_Regulators (F1.2 LED1.1 MP3.1)
ASMS_ON: AS_Node_Connectors (P1.17), AS_Node_Inputs (C17.2 R26.1 R27.1)
EBS_OK: AS_Node_Connectors (P2.15), AS_Node_Inputs (C18.2 R28.1 R29.1)